# EAGLE design pwrthougts (EAGLE 9.6.2)
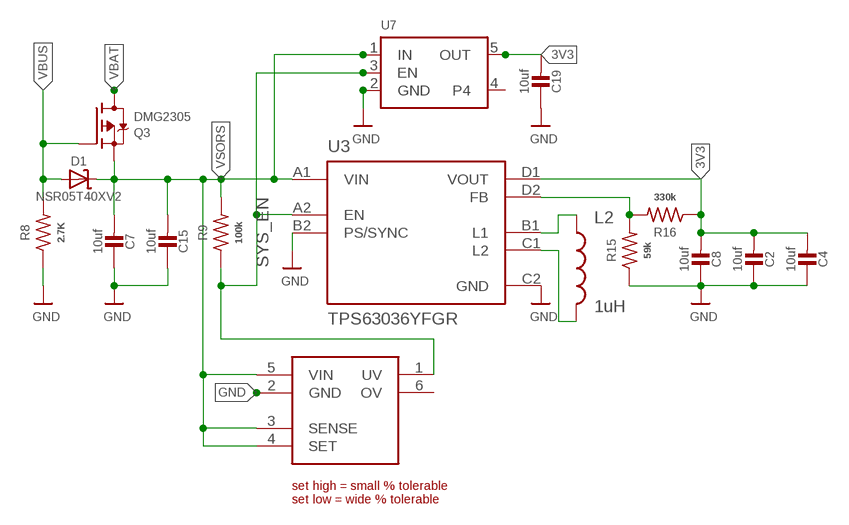
[diagram p0: schematic, sheet 1]

## Parts
C2  10uf  C-US__0402_NOMASK  [MICROBUILDER__0402_NODIMS]
C4  10uf  C-US__0402_NOMASK  [MICROBUILDER__0402_NODIMS]
C7  10uf  C-US__0402_NOMASK  [MICROBUILDER__0402_NODIMS]
C8  10uf  C-US__0402_NOMASK  [MICROBUILDER__0402_NODIMS]
C15  10uf  C-US__0402_NOMASK  [MICROBUILDER__0402_NODIMS]
C19  10uf  C-US__0402_NOMASK  [MICROBUILDER__0402_NODIMS]
D1  NSR05T40XV2  DIODE-SCHOTTKYSOD-523  [SOD-523]
L2  1uH  INDUCTOR_1UHMEDIUM_CURRENT  [NONSTANDARD_INDUCTOR_5]
Q3  DMG2305  MOSFET-P  [SOT23-R]
R8  2.7K  R_TG_0402  [TG_0402]
R9  100k  R_TG_0402  [TG_0402]
R15  59k  R_TG_0402  [TG_0402]
R16  330k  R_TG_0402  [TG_0402]
U3  TPS63036YFGR  [BGA8N40P4X2_181X107X62N]
U7  VREG_STD_MIN_SOT23-5  [SOT23-5]
U8  UNDERVOLT-TPS3702CX3  [SOT95P280X110-6N]

## Nets
3V3 [power]: C2.2 C4.2 C8.2 C19.2 R16.1 U3.D1(VOUT) U7.5(OUT)
GND: C2.1 C4.1 C7.1 C8.1 C15.1 C19.1 R8.1 R15.1 U3.B2(PS/SYNC) U3.C2(GND) U7.2(GND) U8.2(GND)
L1: L2.1 U3.B1(L1)
L2: L2.2 U3.C1(L2)
SENSE: R15.2 R16.2 U3.D2(FB)
SYS_EN: R9.1 U3.A2(EN) U7.3(EN) U8.1(UV)
VBAT [power]: Q3.3(D)
VBUS [power]: D1.A Q3.1(G) R8.2
VSORS: C7.2 C15.2 D1.K(C) Q3.2(S) R9.2 U3.A1(VIN) U7.1(IN) U8.3(SENSE) U8.4(SET) U8.5(VIN)
Unconnected: U7.4 U8.6(OV)

## Library data of the parts
C2 C4 C7 C8 C15 C19 = 0TG-Lib v01.5:C-US_: from: microbuilder Ceramic Capacitors For new designs, use the packages preceded by an '_' character since they are more reliable: The following footprints should be used on most boards: _0402 - Standard footprint for regular board layouts _0603 - Standard footprint for regular board layouts _0805 - Standard footprint for regular board layouts _1206 - Standard footprint for regular board layouts For extremely tight-pitch boards where space is at a premium, the following 'micro-pitch' footprints can be used (smaller pads, no silkscreen outline, etc.): _0402MP - Micro-pitch footprint for very dense/compact boards _0603MP - Micro-pitch footprint for very dense/compact boards _0805MP - Micro-pitch footprint for very dense/compact boards _1206MP - Micro-pitch footprint for very dense/compact boards
D1 = microbuilder:DIODE-SCHOTTKY
L2 = FPV_Static-Lib_v1.1:INDUCTOR_1UH
Q3 = microbuilder:MOSFET-P: P-Channel Mosfet LEGEND VDS: Voltage Drain-Source ID: Drain Current RDS(ON): Drain-Source On-State Resistance VGS(TH): Gate-Source Threshold Voltage CISS: Drain-Source Input Capacitance SOT-23 Name VDS ID RDS(ON) VGS(TH) CISS Order Number IRLML5103 30V 760mA 600 mOhm -- 75pF @ 25V Digikey: IRLML5103PBFCT-ND IRLML6401 12V 4.3A 50 mOhm 950mV @ 250µA 830pF @ 10V Digikey: IRLML6401PBFTR-ND NTR0202PL 20V 400mA 800 mOhm 2.3V @ 250uA 70pF @ 5V Digikey: NTR0202PLT1GOSTR-ND NTR4101PT1G 20V 1.8A 85 mOhm 1.2V @ 250uA 675pF @ 10V Digikey: NTR4101PT1GOSCT-ND DMP2004K 20V 600mA 900 mOhm 1V @ 250uA 175pF @ 16V Digikey: DMP2004KDICT-ND PMV65XP 20V 3.9A 76 mOhm 950mV @ 1mA 725pF @ 20V Digikey: 568-2358-2-ND TO-252 Name VDS ID RDS(ON) VGS(TH) CISS Order Number AOD417 30V 25A 34 mOhm 3V @ 250µA 920pF @ 15V Digikey: 785-1106-2-ND PowerPak Name VDS ID RDS(ON) VGS(TH) CISS Order Number AON7401 30V 12A 14 mOhm 3V @ 250µA 2600pF @ 15V Digikey: 785-1302-1-ND
R8 R9 R15 R16 = 0TG-Lib v01.5:R_TG
U3 = TPS63036YFGR:TPS63036YFGR: High Efficient Single Inductor Buck-Boost Converter with 1-A Switches 8-DSBGA -40 to 85 Check prices <https://pricing.snapeda.com/parts/TPS63036YFGR/Texas%20Instruments/view-part?ref=eda>; AVAILABILITY: Bad; DESCRIPTION: High Efficient Single Inductor Buck-Boost Converter with 1-A Switches 8-DSBGA -40 to 85; MF: Texas Instruments; MP: TPS63036YFGR; PACKAGE: DSBGA-8 Texas Instruments; PRICE: None; PURCHASE-URL: https://pricing.snapeda.com/search/part/TPS63036YFGR/?ref=eda
U7 = 0TG-Lib v01.4:VREG_STD_MIN_SOT23-5: SOT23-5 Fixed Voltage Regulators from: adafruit Part Current Out V Out V In V Dropout θJA (°C/W) TJ (°C) Digikey Part No. ADP121 150mA 3.3V 3.4-5.5V 0.09V @ 150mA -- -- ADP121-AUJZ33R7CT-ND ADP121 150mA 3.0V 3.1-5.5V 0.09V @ 150mA -- -- ADP121-AUJZ30R7CT-ND ADP122 300mA 3.3V 3.4-5.5V 0.085V @ 300mA -- -- ADP122AUJZ-3.3-R7CT-ND ADP1712 300mA 3.3V 3.5-5.5V 0.17V @ 300mA -- -- ADP1712AUJZ-3.3-R7TR-ND AP7311 (Low Cost) 150mA 3.3V 3.5-6V 0.15V @ 150mA -- -- AP7311-33WG-7DICT-ND LD39015M18R 150mA 1.8V 1.9V-5.5V 0.08V @ 100mA -- -- 497-6977-1-ND LP2985A-33DBVR 150mA 3.3V 3.3-16V 0.28V @ 150mA 206 150 296-18479-1-ND MCP1824T-3302E/OT 300mA 3.3V 3.5V-6V 0.2V @ 300mA -- -- MCP1824T-3302E/OTCT-ND MIC5205-2.5YM5 TR 150mA 2.5V 2.7-16V 0.165V @ 150mA -- -- 576-1257-2-ND MIC5205-3.0YM5 TR 150mA 3.0V 3.2V-16V 0.165V @ 150mA -- -- 576-1258-2-ND MIC5205-3.3YM5 TR 150mA 3.3V 3.5V-16V 0.165V @ 150mA -- -- 576-1259-2-ND TPS780330220 150mA 3.3V+2.2V 3.6-5.5V 250mV Max -- -- 296-23332-1-ND TDA3663/N1,135 100mA 3.3V 3.5-45V 0.18V @ 50mA -- -- 568-5343-1-ND Max operating temp can be calculated using θJA, TJ (max junction temperature), and power in watts. Set the "Maximum Ambient Temperature" until it reaches TJ ("Max Junction Temperature"), which is the absolute limit for safe use of the regulator: Heat Sink Temperature Calculator <http://www.daycounter.com/Calculators/Heat-Sink-Temperature-Calculator.phtml> For example, With 12V source into a 3.3V LP2985 and a 30mA load, we are dissipating (12V-3.3V) * 0.03A = 0.261W. With a θJA of 206 °C/W, a TJ of 150°C, and 261mW we can safely use the chip without a heat sink up to 75°C (=147.1°C Junction Temperature).
U8 = 0TG-Lib v01.4:UNDERVOLT-TPS3702CX3

## Net classes
1 power: width 0.254 mm

## Board
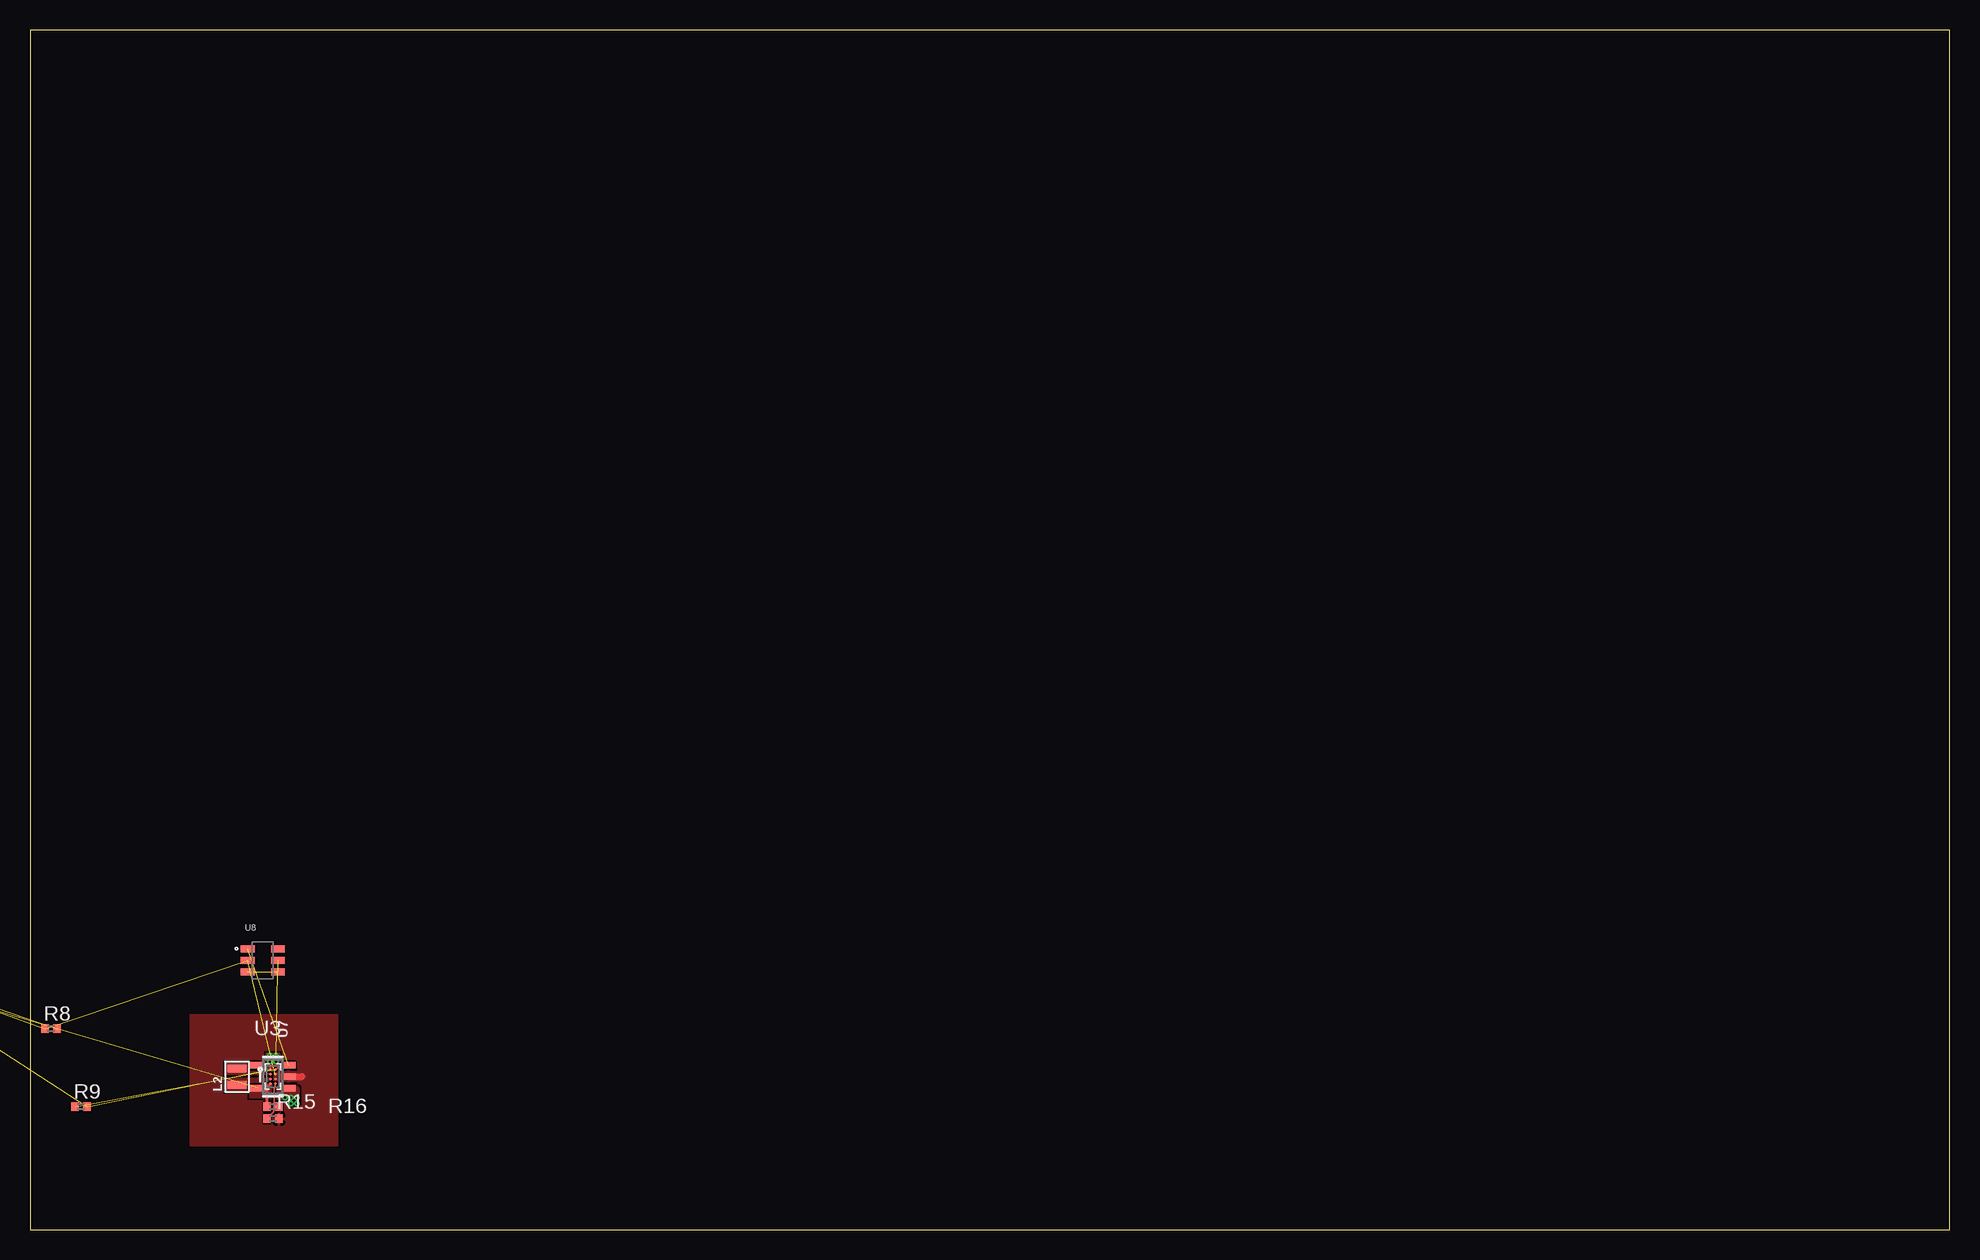
[diagram p1: board, top side]
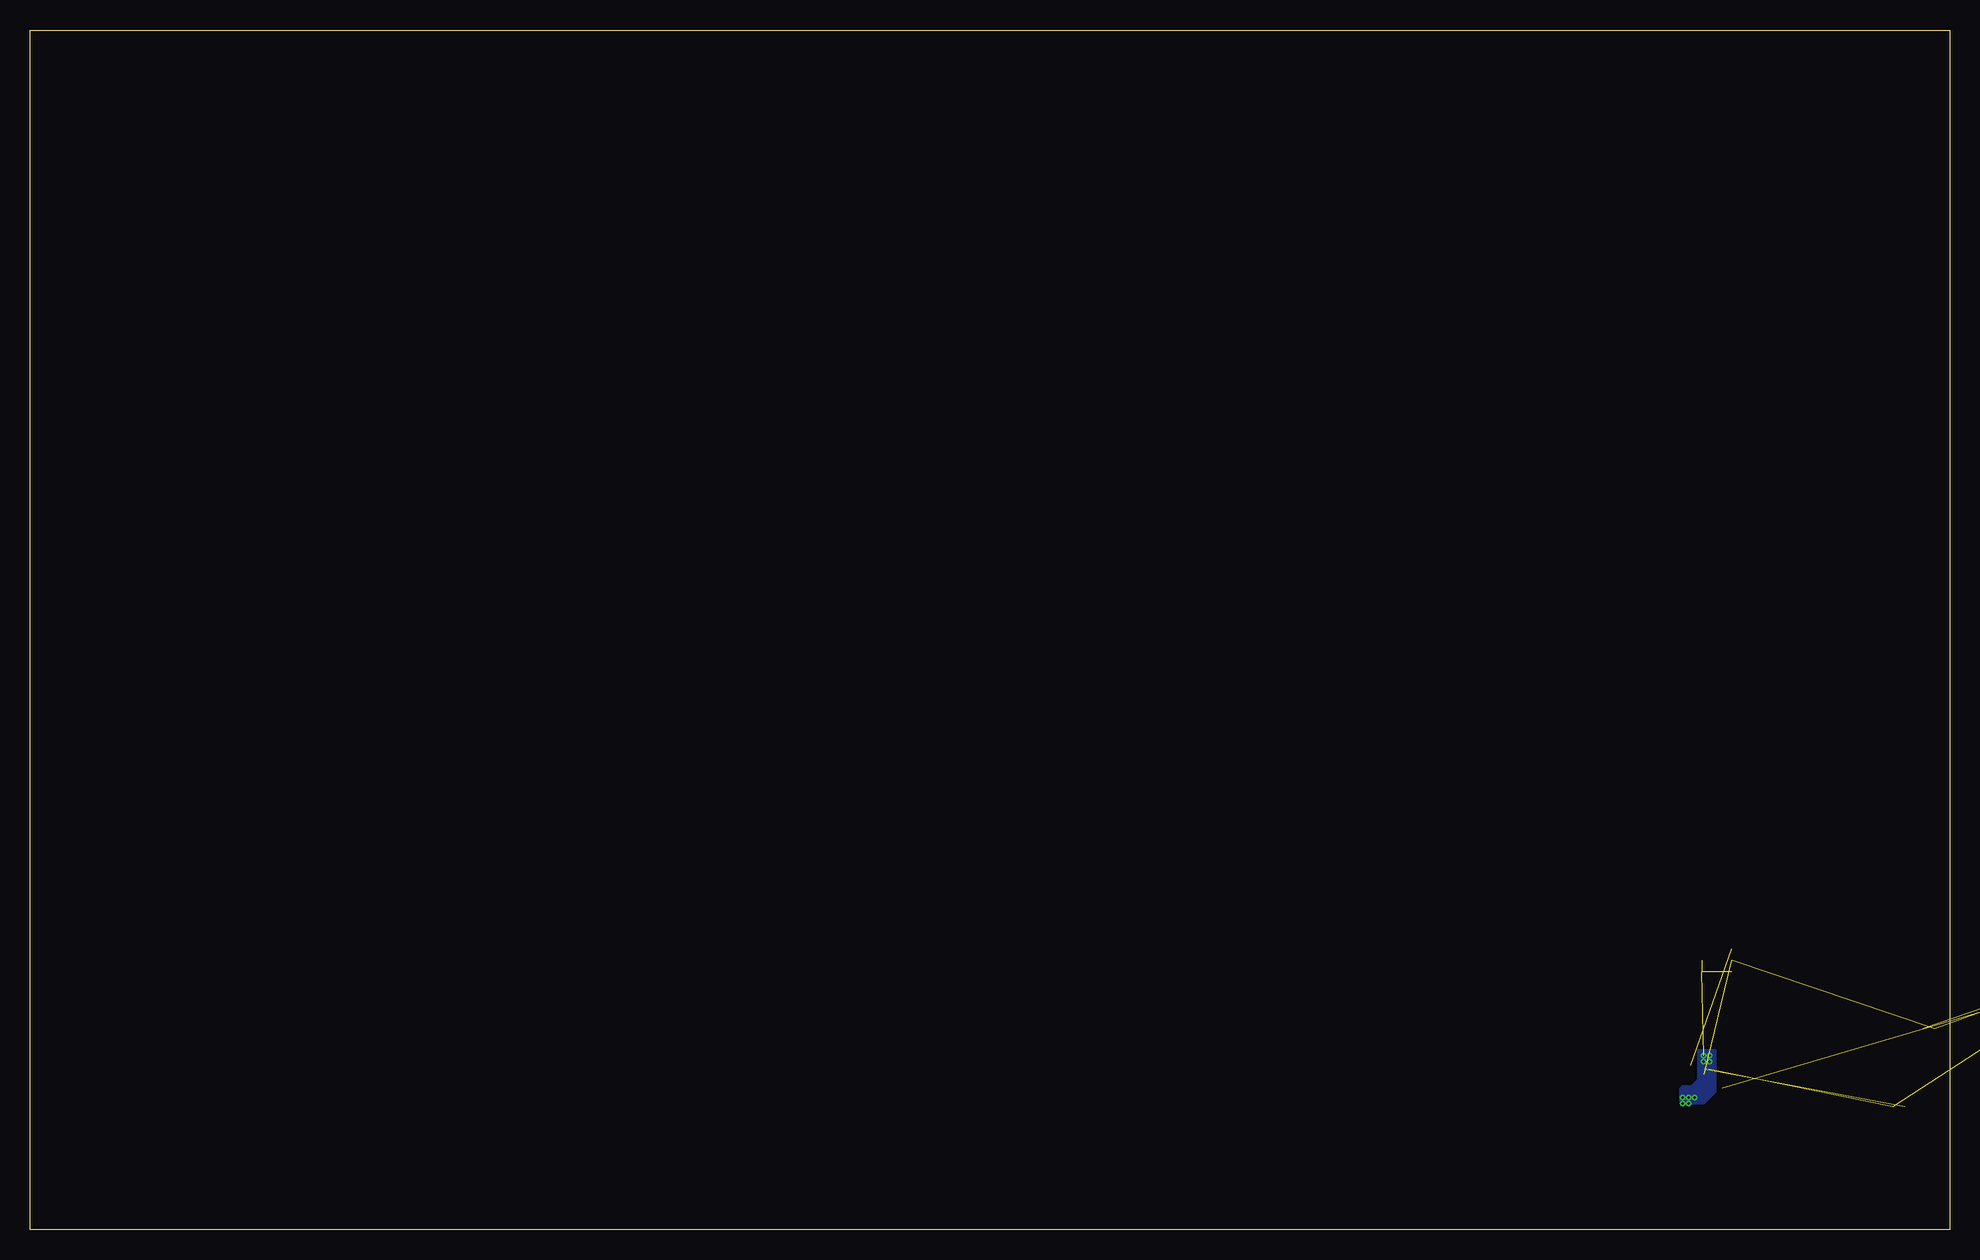
[diagram p2: board, bottom side, seen from below]

Size 160 x 100 mm. Coordinates in mm from the lower left corner, seen from the top.
Outline: 0,0 160,0 160,100 0,100 0,0
Copper layers (1*16): Top 0.035mm / dielectric 0.53mm / Bottom 0.035mm
Design rules "jlc-tg-watch02": minimum track width 5mil, minimum drill 0.2mm, track to track 5mil, track to pad 6mil, pad to pad 6mil, via to via 6mil, smd to smd 6mil, copper to edge 40mil, drill to drill 6mil, minimum pad ring 10mil, minimum via ring 0.125mm, stop-mask expansion 4mil, vias tented up to drill 10000mil, thermal gap 10mil

### Footprints (pad centres in the part's own frame; a part is rotated, then mirrored left to right if it is on the bottom)
MICROBUILDER__0402_NODIMS = smd 0.6 x 0.6: 1 -0.508,0; 2 0.508,0
SOD-523 = smd 0.8 x 0.6: A 0,-0.75; K 0,0.75
NONSTANDARD_INDUCTOR_5 = smd 0.65 x 1.6: 1 0.675,0; 2 -0.675,0
SOT23-R = smd 0.635 x 1.016: 1 -0.95,-1; 2 0.95,-1; 3 0,1
TG_0402 = smd 0.6 x 0.7: 1 -0.5,0; 2 0.5,0
BGA8N40P4X2_181X107X62N = smd 0.25 x 0.25: A1 -0.2,0.6; A2 0.2,0.6; B1 -0.2,0.2; B2 0.2,0.2; C1 -0.2,-0.2; C2 0.2,-0.2; D1 -0.2,-0.6; D2 0.2,-0.6
SOT23-5 = smd 0.55 x 1.2: 1 -0.95,-1.3; 2 0,-1.3; 3 0.95,-1.3; 4 0.95,1.3; 5 -0.95,1.3
SOT95P280X110-6N = smd 1.25 x 0.59: 1 -1.255,0.95; 2 -1.255,0; 3 -1.255,-0.95; 4 1.255,-0.95; 5 1.255,0; 6 1.255,0.95

### Placement (x,y rotation side)
C2  -21.59,22.86 0 top  (outside the outline)
C4  -24.13,22.86 0 top  (outside the outline)
C7  -26.67,22.86 0 top  (outside the outline)
C8  -29.21,22.86 0 top  (outside the outline)
C15  -15.24,22.86 0 top  (outside the outline)
C19  -19.05,22.86 0 top  (outside the outline)
D1  -30.48,26.67 0 top  (outside the outline)
L2  17.25,12.75 90 top
Q3  -22.86,26.67 0 top  (outside the outline)
R8  1.75,16.75 0 top
R9  4.25,10.25 0 top
R15  20.25,9.25 180 top
R16  20.25,10.25 0 top
U3  20.25,12.75 0 top
U7  20.25,12.75 90 top
U8  19.41,22.43 0 top

### Tracks (layer width: path | path; a pad name or v marks a point on that pad's centre or on a via)
3V3  (4 unrouted)
  Top 0.254: R16.1 19.75,11.85 U3.D1
  pour Top (no thermals): 18.3,12.05 19.75,12.05 19.9,12.2 20.15,12.2 20.15,10.95 18.3,10.95
GND  (8 unrouted)
  Top 0.6: U7.2 22.65,12.75
  pour Top (rank 5): 13.4,7 13.4,17.9 20.95,17.9 25.6,17.9 25.6,10 25.6,7
  pour Top (no thermals): 20.45,12.45 20.45,13.05 20.6,13.2 22.4,13.2 22.4,12.3 20.6,12.3
L1
  pour Top (rank 2, no thermals): 20.1,12.9 16.25,12.9 16.25,14 18.05,14 18.05,13.2 20.1,13.2
L2
  pour Top (rank 2, no thermals): 16.25,12.6 16.25,11.5 18.05,11.5 18.05,12.25 20.05,12.25 20.05,12.6
SENSE
  Top 0.127: U3.D2 20.45,11.92 20.35,11.82 20.35,10.18 | R15.2 20.3,9.8 20.3,10.13 20.35,10.18 | 20.35,10.18 20.42,10.25 20.65,10.25
  Top 0.152: 20.58,10.25 20.65,10.25 R16.2
SYS_EN  (2 unrouted)
  Top 0.152: U3.A2 20.5,13.35 20.85,13.7 U7.3
VBUS  (2 unrouted)
VSORS  (via drill 0.2)  (8 unrouted)
  Top 0.127: U3.A1 20,13.4 v20,14
  other vias: 20.5,14 20,14.5 20.5,14.5 22.25,11 21.25,11 21.75,11 22.25,10.5 21.75,10.5
  pour Top (no thermals): 20.6,10.85 20.6,12 22.25,12 22.45,11.8 22.45,10.85
  pour Top (no thermals): 20.2,13.25 19.95,13.25 19.7,13.5 19.7,14.55 20.8,14.55 20.8,13.85
  pour Top (no thermals): 20.2,13.2 19.95,13.2 19.7,13.45 19.7,14.75 20.8,14.75 20.8,13.8
  pour Bottom: 19.5,15 21,15 21,12.5 21.25,12.25 21.5,12 22.25,12 22.5,11.75 22.5,11.25 22.5,10.75 22.25,10.5 20.5,10.5 20,11 19.5,11.5